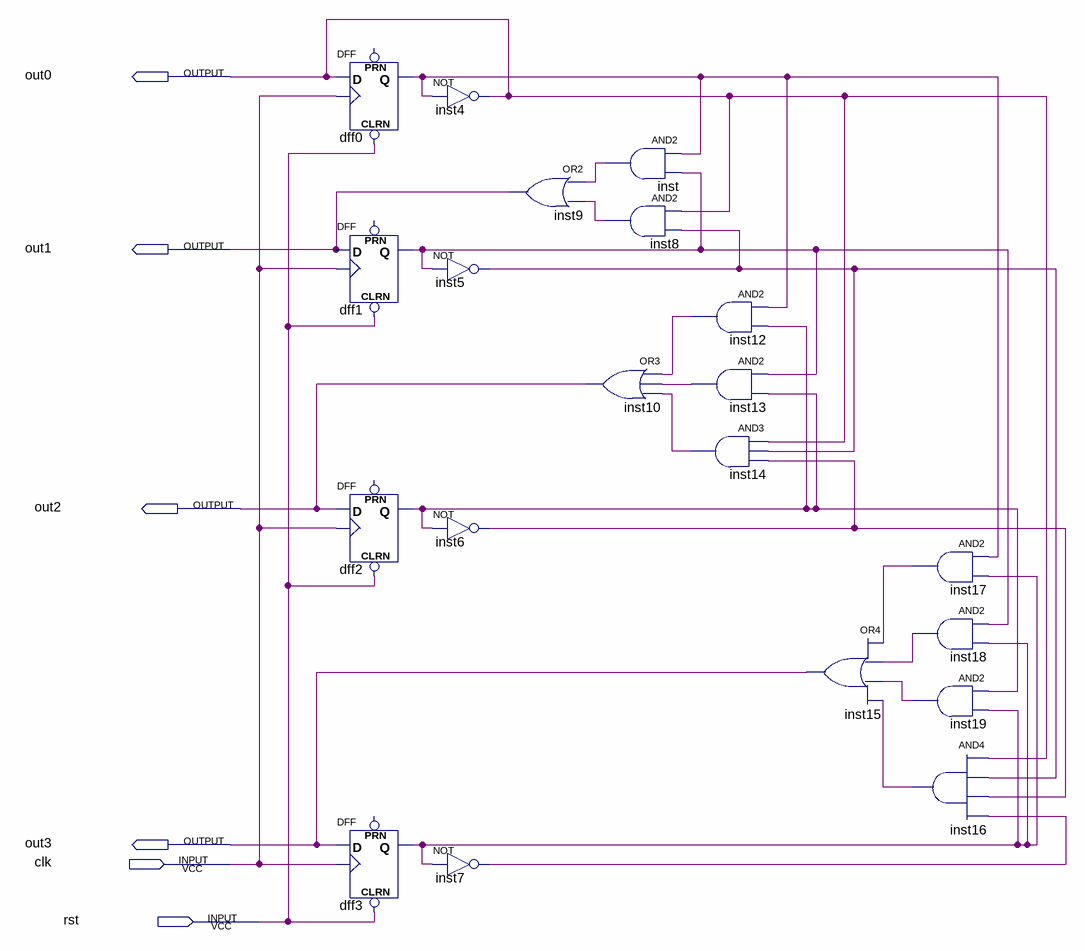
[diagram p0: schematic sheet]
// Quartus schematic counter.bdf as structural Verilog: 20 symbols, 6 pins
module counter (
  input  clk,
  input  rst,
  output out0,
  output out1,
  output out2,
  output out3
);

  wire dff0_q, dff1_q, dff2_q, dff3_q, inst5_out, inst6_out, inst7_out, inst8_out, inst12_out, inst13_out,
       inst14_out, inst16_out, inst17_out, inst18_out, inst19_out, inst_out;

  DFF dff0 (.CLRN(rst), .CLK(clk), .D(out0), .Q(dff0_q));  // open: PRN
  DFF dff1 (.CLRN(rst), .CLK(clk), .D(out1), .Q(dff1_q));  // open: PRN
  DFF dff2 (.CLRN(rst), .CLK(clk), .D(out2), .Q(dff2_q));  // open: PRN
  DFF dff3 (.CLRN(rst), .CLK(clk), .D(out3), .Q(dff3_q));  // open: PRN
  not inst4 (out0, dff0_q);
  not inst5 (inst5_out, dff1_q);
  not inst6 (inst6_out, dff2_q);
  not inst7 (inst7_out, dff3_q);
  or inst9 (out1, inst_out, inst8_out);
  and inst (inst_out, dff0_q, dff1_q);
  and inst8 (inst8_out, out0, inst5_out);
  or inst10 (out2, inst12_out, inst13_out, inst14_out);
  and inst12 (inst12_out, dff0_q, dff2_q);
  and inst13 (inst13_out, dff1_q, dff2_q);
  and inst14 (inst14_out, out0, inst5_out, inst6_out);
  or inst15 (out3, inst17_out, inst18_out, inst19_out, inst16_out);
  and inst17 (inst17_out, dff0_q, dff3_q);
  and inst18 (inst18_out, dff1_q, dff3_q);
  and inst19 (inst19_out, dff2_q, dff3_q);
  and inst16 (inst16_out, out0, inst5_out, inst6_out, inst7_out);
endmodule
